# EAGLE design can-universalmodul (EAGLE 7.2.0)
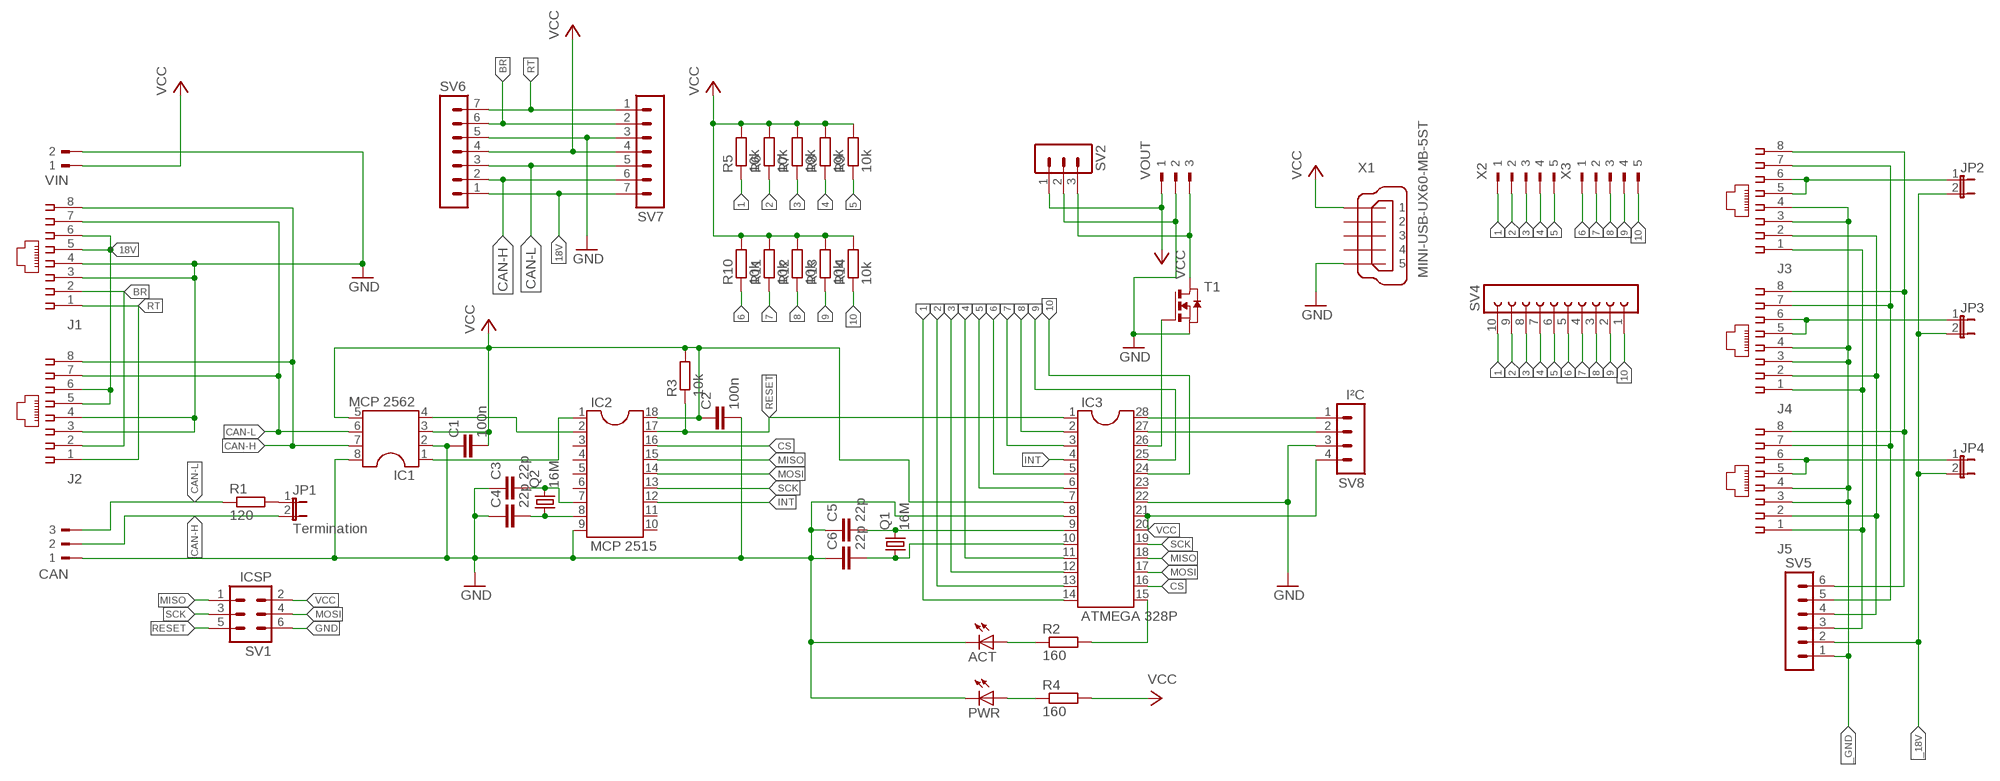
[diagram p0: schematic, sheet 1]

## Parts
ACT  LEDCHIP-LED0805  [CHIP-LED0805]
C1  100n  C-EUC0805K  [C0805K]
C2  100n  C-EUC0805K  [C0805K]
C3  22p  C-EUC0805K  [C0805K]
C4  22p  C-EUC0805K  [C0805K]
C5  22p  C-EUC0805K  [C0805K]
C6  22p  C-EUC0805K  [C0805K]
CAN  90-3  [90-3]
IC1  MCP 2562  DIL8S  [SOCKET-08]
IC2  MCP 2515  DIL18S  [SOCKET-18]
IC3  ATMEGA 328P  DIL28-3  [DIL28-3]
J1  215877-7  [215877-7]
J2  215877-7  [215877-7]
J3  215877-7  [215877-7]
J4  215877-7  [215877-7]
J5  215877-7  [215877-7]
JP1  Termination  JP1E  [JP1]
JP2  JP1E  [JP1]
JP3  JP1E  [JP1]
JP4  JP1E  [JP1]
PWR  LEDCHIP-LED0805  [CHIP-LED0805]
Q1  16M  CSM-7X-DU  [CSM-7X-DU]
Q2  16M  CSM-7X-DU  [CSM-7X-DU]
R1  120  R-EU_R0805  [R0805]
R2  160  R-EU_R0805  [R0805]
R3  10k  R-EU_R0805  [R0805]
R4  160  R-EU_R0805  [R0805]
R5  10k  R-EU_R0805  [R0805]
R6  10k  R-EU_R0805  [R0805]
R7  10k  R-EU_R0805  [R0805]
R8  10k  R-EU_R0805  [R0805]
R9  10k  R-EU_R0805  [R0805]
R10  10k  R-EU_R0805  [R0805]
R11  10k  R-EU_R0805  [R0805]
R12  10k  R-EU_R0805  [R0805]
R13  10k  R-EU_R0805  [R0805]
R14  10k  R-EU_R0805  [R0805]
SV1  ICSP  MA03-2  [MA03-2]
SV2  MA03-1  [MA03-1]
SV4  FE10W  [FE10W]
SV5  MA06-1  [MA06-1]
SV6  MA07-1  [MA07-1]
SV7  MA07-1  [MA07-1]
SV8  I²C  MA04-1  [MA04-1]
T1  NMOSSOT23  [SOT-23]
VIN  90-2  [90-2]
VOUT  90-3  [90-3]
X1  MINI-USB-UX60-MB-5ST  [UX60-MB-5ST]
X2  90-5  [90-5]
X3  90-5  [90-5]

## Nets
1: IC3.14 R5.1 SV4.10 X2.1
2: IC3.13 R6.1 SV4.9 X2.2
3: IC3.12 R7.1 SV4.8 X2.3
4: IC3.11 R8.1 SV4.7 X2.4
5: IC3.6 R9.1 SV4.6 X2.5
6: IC3.5 R10.1 SV4.5 X3.1
7: IC3.3 R11.1 SV4.4 X3.2
8: IC3.2 R12.1 SV4.3 X3.3
9: IC3.25 R13.1 SV4.2 X3.4
10: IC3.24 R14.1 SV4.1 X3.5
18V: J1.5 J1.6 J2.5 J2.6 SV6.1 SV7.7
_18V: JP2.2 JP3.2 JP4.2 SV5.2
_GND: J3.3 J3.4 J4.3 J4.4 J5.3 J5.4 SV5.1
BR: J1.2 J2.2 SV6.6 SV7.2
CAN-H: CAN.2 IC1.7 J1.8 J2.8 JP1.2 SV6.2 SV7.6
CAN-L: CAN.3 IC1.6 J1.7 J2.7 R1.1 SV6.3 SV7.5
CS: IC2.16 IC3.16
GND: ACT.C C1.1 C2.2 C3.1 C4.1 C5.1 C6.1 CAN.1 IC1.2 IC1.8 IC2.9 IC3.8 IC3.22 J1.3 J1.4 J2.3 J2.4 PWR.C SV1.6 SV2.2 SV6.5 SV7.3 SV8.3 T1.2(S) VIN.2 VOUT.2 X1.5
INT: IC2.12 IC3.4
MISO: IC2.15 IC3.18 SV1.1
MOSI: IC2.14 IC3.17 SV1.4
N$1: J5.5 J5.6 JP4.1
N$2: IC1.4 IC2.2
N$3: J4.5 J4.6 JP3.1
N$4: C4.2 IC2.8 Q2.1
N$5: JP1.1 R1.2
N$6: C3.2 IC2.7 Q2.2
N$7: C5.2 IC3.9 Q1.2
N$8: C6.2 IC3.10 Q1.1
N$9: IC1.1 IC2.1
N$10: J3.5 J3.6 JP2.1
N$11: J3.1 J4.1 J5.1 SV5.3
N$12: ACT.A R2.1
N$13: IC3.15 R2.2
N$14: J3.2 J4.2 J5.2 SV5.4
N$15: J3.7 J4.7 J5.7 SV5.5
N$16: J3.8 J4.8 J5.8 SV5.6
N$20: PWR.A R4.1
N$21: IC3.26 T1.3(G)
N$22: SV2.3 T1.1(D) VOUT.3
N$33: IC3.28 SV8.1
N$34: IC3.27 SV8.2
RESET: IC2.17 IC3.1 R3.1 SV1.5
RT: J1.1 J2.1 SV6.7 SV7.1
SCK: IC2.13 IC3.19 SV1.3
VCC: C1.2 C2.1 IC1.3 IC1.5 IC2.18 IC3.7 IC3.20 IC3.21 R3.2 R4.2 R5.2 R6.2 R7.2 R8.2 R9.2 R10.2 R11.2 R12.2 R13.2 R14.2 SV1.2 SV2.1 SV6.4 SV7.4 SV8.4 VIN.1 VOUT.1 X1.1
Unconnected: IC2.3 IC2.4 IC2.5 IC2.6 IC2.10 IC2.11 IC3.23 X1.2 X1.3 X1.4

## Library data of the parts
ACT PWR = led:LED: LED OSRAM: - CHIPLED LG R971, LG N971, LY N971, LG Q971, LY Q971, LO R971, LY R971 LH N974, LH R974 LS Q976, LO Q976, LY Q976 LO Q996 - Hyper CHIPLED LW Q18S LB Q993, LB Q99A, LB R99A - SideLED LS A670, LO A670, LY A670, LG A670, LP A670 LB A673, LV A673, LT A673, LW A673 LH A674 LY A675 LS A676, LA A676, LO A676, LY A676, LW A676 LS A679, LY A679, LG A679 - Hyper Micro SIDELED® LS Y876, LA Y876, LO Y876, LY Y876 LT Y87S - SmartLED LW L88C, LW L88S LB L89C, LB L89S, LG L890 LS L89K, LO L89K, LY L89K LS L896, LA L896, LO L896, LY L896 - TOPLED LS T670, LO T670, LY T670, LG T670, LP T670 LSG T670, LSP T670, LSY T670, LOP T670, LYG T670 LG T671, LOG T671, LSG T671 LB T673, LV T673, LT T673, LW T673 LH T674 LS T676, LA T676, LO T676, LY T676, LB T676, LH T676, LSB T676, LW T676 LB T67C, LV T67C, LT T67C, LS T67K, LO T67K, LY T67K, LW E67C LS E67B, LA E67B, LO E67B, LY E67B, LB E67C, LV E67C, LT E67C LW T67C LS T679, LY T679, LG T679 LS T770, LO T770, LY T770, LG T770, LP T770 LB T773, LV T773, LT T773, LW T773 LH T774 LS E675, LA E675, LY E675, LS T675 LS T776, LA T776, LO T776, LY T776, LB T776 LHGB T686 LT T68C, LB T68C - Hyper Mini TOPLED® LB M676 - Mini TOPLED Santana® LG M470 LS M47K, LO M47K, LY M47K Source: http://www.osram.convergy.de LUXEON: - LUMILED® LXK2-PW12-R00, LXK2-PW12-S00, LXK2-PW14-U00, LXK2-PW14-V00 LXK2-PM12-R00, LXK2-PM12-S00, LXK2-PM14-U00 LXK2-PE12-Q00, LXK2-PE12-R00, LXK2-PE12-S00, LXK2-PE14-T00, LXK2-PE14-U00 LXK2-PB12-K00, LXK2-PB12-L00, LXK2-PB12-M00, LXK2-PB14-N00, LXK2-PB14-P00, LXK2-PB14-Q00 LXK2-PR12-L00, LXK2-PR12-M00, LXK2-PR14-Q00, LXK2-PR14-R00 LXK2-PD12-Q00, LXK2-PD12-R00, LXK2-PD12-S00 LXK2-PH12-R00, LXK2-PH12-S00 LXK2-PL12-P00, LXK2-PL12-Q00, LXK2-PL12-R00 Source: www.luxeon.com KINGBRIGHT: KA-3528ASYC Source: www.kingbright.com
C1-C6 = rcl:C-EU: CAPACITOR, European symbol
CAN VOUT = con-weidmueller-sl35:90-3: WEIDMUELLER CLAMP CONNECTOR; OC_FARNELL: unknown; OC_NEWARK: unknown
IC1 = ic-package:DIL8: Dual In Line / Socket
IC2 = ic-package:DIL18: Dual In Line / Socket
IC3 = ic-package:DIL28: Dual In Line
J1-J5 = con-amp:215877-7: AMP connector
JP1-JP4 = jumper:JP1E: JUMPER
Q1 Q2 = crystal:CSM-7X-DU: SMD CRYSTAL Source: www.ecsxtal.com .. Crystal 3.6864MHz CSM_7X_DU.PDF; OC_FARNELL: unknown; OC_NEWARK: unknown
R1-R14 = rcl:R-EU_: RESISTOR, European symbol
SV1 = con-lstb:MA03-2: PIN HEADER; OC_FARNELL: unknown; OC_NEWARK: unknown
SV2 = con-lstb:MA03-1: PIN HEADER; OC_FARNELL: unknown; OC_NEWARK: unknown
SV4 = con-lsta:FE10W: FEMALE HEADER; OC_FARNELL: unknown; OC_NEWARK: unknown
SV5 = con-lstb:MA06-1: PIN HEADER; OC_FARNELL: unknown; OC_NEWARK: unknown
SV6 SV7 = con-lstb:MA07-1: PIN HEADER; OC_FARNELL: unknown; OC_NEWARK: unknown
SV8 = con-lstb:MA04-1: PIN HEADER; OC_FARNELL: unknown; OC_NEWARK: unknown
T1 = zetex:NMOSSOT23: MOS FET; OC_FARNELL: unknown; OC_NEWARK: unknown
VIN = con-weidmueller-sl35:90-2: WEIDMUELLER CLAMP CONNECTOR; OC_FARNELL: unknown; OC_NEWARK: unknown
X1 = con-hirose:MINI-USB-: MINI USB Connector Source: http://www.hirose.co.jp/cataloge_hp/e24000019.pdf; OC_FARNELL: unknown; OC_NEWARK: unknown
X2 X3 = con-weidmueller-sl35:90-5: WEIDMUELLER CLAMP CONNECTOR; OC_FARNELL: unknown; OC_NEWARK: unknown

## Board
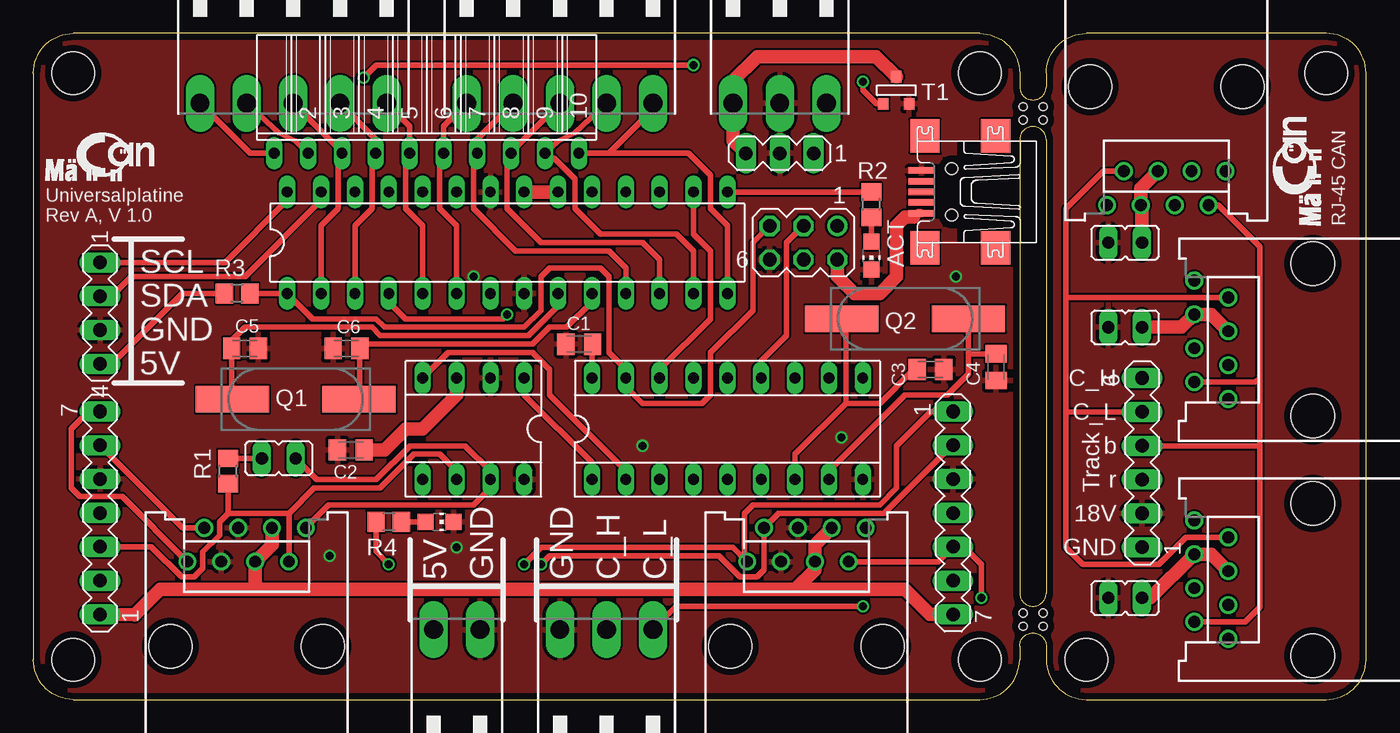
[diagram p1: board, top side]
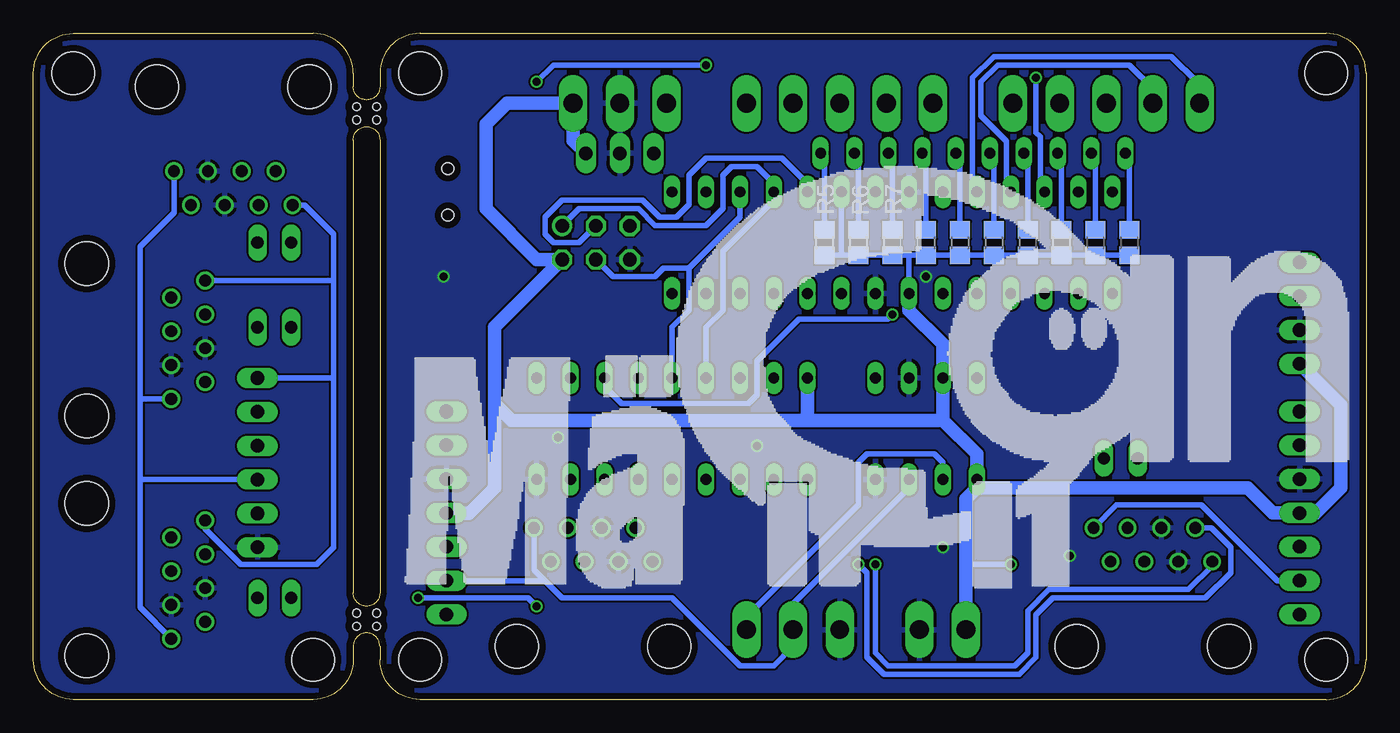
[diagram p2: board, bottom side, seen from below]

Size 100 x 50 mm. Coordinates in mm from the lower left corner, seen from the top.
Outline: 3,0 71,0 arc90 74,3 74,4 arc-90 75,5 arc-90 76,4 76,3 arc90 79,0 97,0 arc90 100,3 100,47 arc90 97,50 79,50 arc90 76,47 76,46 arc-90 75,45 arc-90 74,46 74,47 arc90 71,50 3,50 arc90 0,47 0,3 arc90 3,0
Outline: 74,42 74,8 arc90 75,7 arc90 76,8 76,42 arc90 75,43 arc90 74,42
Copper layers (1*16): Top 0.035mm / dielectric 1.6mm / Bottom 0.035mm
Design rules "Elecrow_2-layer_PCB_eagle_rule": minimum track width 6mil, minimum drill 12mil, track to track 6mil, track to pad 6mil, pad to pad 6mil, via to via 8mil, smd to smd 0mil, copper to edge 20mil, drill to drill 10mil, minimum pad ring 6mil, minimum via ring 6mil, stop-mask expansion 0mil, vias tented up to drill 100mil, thermal gap 10mil
Holes 3.2 mm at 3,3 71,3 3,47 71,47 79,3 97,47
Holes 0.6 mm at 74.25,6.5 74.25,5.5 75.75,6.5 75.75,5.5 74.25,44.5 74.25,43.5 75.75,44.5 75.75,43.5

### Footprints (pad centres in the part's own frame; a part is rotated, then mirrored left to right if it is on the bottom)
CHIP-LED0805 = smd 1.2 x 1.2: A 0,-1.05; C 0,1.05
C0805K = smd 1.3 x 1.6: 1 -1,0; 2 1,0
90-3 = drill 1.422 long: 1 -3.5,5.25; 2 0,5.25; 3 3.5,5.25
SOCKET-08 = drill 0.813 long: 1 -3.81,-3.81; 2 -1.27,-3.81; 3 1.27,-3.81; 4 3.81,-3.81; 5 3.81,3.81; 6 1.27,3.81; 7 -1.27,3.81; 8 -3.81,3.81
SOCKET-18 = drill 0.813 long: 1 -10.16,-3.81; 2 -7.62,-3.81; 3 -5.08,-3.81; 4 -2.54,-3.81; 5 0,-3.81; 6 2.54,-3.81; 7 5.08,-3.81; 8 7.62,-3.81; 9 10.16,-3.81; 10 10.16,3.81; 11 7.62,3.81; 12 5.08,3.81; 13 2.54,3.81; 14 0,3.81; 15 -2.54,3.81; 16 -5.08,3.81; 17 -7.62,3.81; 18 -10.16,3.81
DIL28-3 = drill 0.813 long: 1 -16.51,-3.81; 2 -13.97,-3.81; 3 -11.43,-3.81; 4 -8.89,-3.81; 5 -6.35,-3.81; 6 -3.81,-3.81; 7 -1.27,-3.81; 8 1.27,-3.81; 9 3.81,-3.81; 10 6.35,-3.81; 11 8.89,-3.81; 12 11.43,-3.81; 13 13.97,-3.81; 14 16.51,-3.81; 15 16.51,3.81; 16 13.97,3.81; 17 11.43,3.81; 18 8.89,3.81; 19 6.35,3.81; 20 3.81,3.81; 21 1.27,3.81; 22 -1.27,3.81; 23 -3.81,3.81; 24 -6.35,3.81; 25 -8.89,3.81; 26 -11.43,3.81; 27 -13.97,3.81; 28 -16.51,3.81
215877-7 = drill 0.889: 1 -4.445,6.35; 2 -3.175,8.89; 3 -1.905,6.35; 4 -0.635,8.89; 5 0.635,6.35; 6 1.905,8.89; 7 3.175,6.35; 8 4.445,8.89 | hole 3.251: -5.715,0; 5.715,0
JP1 = drill 0.914 long: 1 0,-1.27; 2 0,1.27
CSM-7X-DU = smd 5.5 x 2: 1 -4.75,0; 2 4.75,0
R0805 = smd 1.3 x 1.5: 1 -0.95,0; 2 0.95,0
MA03-2 = drill 1.016: 1 -2.54,-1.27 | drill 1.016 octagon: 2 -2.54,1.27; 3 0,-1.27; 4 0,1.27; 5 2.54,-1.27; 6 2.54,1.27
MA03-1 = drill 1.016 long: 1 -2.54,0; 2 0,0; 3 2.54,0
FE10W = drill 0.813 long: 1 -11.43,0; 2 -8.89,0; 3 -6.35,0; 4 -3.81,0; 5 -1.27,0; 6 1.27,0; 7 3.81,0; 8 6.35,0; 9 8.89,0; 10 11.43,0
MA06-1 = drill 1.016 long: 1 -6.35,0; 2 -3.81,0; 3 -1.27,0; 4 1.27,0; 5 3.81,0; 6 6.35,0
MA07-1 = drill 1.016 long: 1 -7.62,0; 2 -5.08,0; 3 -2.54,0; 4 0,0; 5 2.54,0; 6 5.08,0; 7 7.62,0
MA04-1 = drill 1.016 long: 1 -3.81,0; 2 -1.27,0; 3 1.27,0; 4 3.81,0
SOT-23 = smd 0.787 x 0.889: 1 0.025,-1.016; 2 -0.94,1.016; 3 0.991,1.016
90-2 = drill 1.422 long: 1 -1.75,5.25; 2 1.75,5.25
UX60-MB-5ST = smd 2 x 0.5: 1 2.25,1.6; 2 2.25,0.8; 3 2.25,0; 4 2.25,-0.8; 5 2.25,-1.6 | smd 2.2 x 2.5: M1 -3.3,-4.2; M2 -3.3,4.2; M3 2,4.2; M4 2,-4.2 | hole 0.9: 0,-1.75; 0,1.75
90-5 = drill 1.422 long: 1 -7,5.25; 2 -3.5,5.25; 3 0,5.25; 4 3.5,5.25; 5 7,5.25

### Placement (x,y rotation side)
ACT  62.87,33.34 180 top
C1  40.96,26.67 0 top
C2  23.81,18.73 180 top
C3  67.31,24.77 180 top
C4  72.23,24.95 90 top
C5  15.88,26.35 180 top
C6  23.5,26.35 0 top
CAN  43,0 0 top
IC1  33.02,20.32 180 top
IC2  52.07,20.32 0 top
IC3  35.56,34.29 0 top
J1  58,4 0 top
J2  16,4 0 top
J3  85,46 180 top
J4  96,9 90 top
J5  96,27 90 top
JP1  18.41,18.1 270 top
JP2  81.92,34.29 90 top
JP3  81.92,7.62 90 top
JP4  81.92,27.94 90 top
PWR  30.48,13.34 270 top
Q1  19.68,22.54 180 top
Q2  65.41,28.57 180 top
R1  14.61,17.14 90 top
R2  62.87,37.15 90 top
R3  15.29,30.48 180 top
R4  26.67,13.34 180 top
R5  40.64,34.29 270 bottom
R6  38.1,34.29 270 bottom
R7  35.56,34.29 270 bottom
R8  33.02,34.29 270 bottom
R9  30.48,34.29 270 bottom
R10  27.94,34.29 270 bottom
R11  25.4,34.29 270 bottom
R12  22.86,34.29 270 bottom
R13  20.32,34.29 270 bottom
R14  17.78,34.29 270 bottom
SV1  57.78,34.29 180 top
SV2  56,41 180 top
SV4  29.5,41 0 top
SV5  83.19,17.78 90 top
SV6  5,14 90 top
SV7  69,14 270 top
SV8  5,29 270 top
T1  64.77,45.72 180 top
VIN  31.77,0 0 top
VOUT  56,50 180 top
X1  68.9,38.1 180 top
X2  39.5,50 180 top
X3  19.5,50 180 top

### Tracks (layer width: path | path; a pad name or v marks a point on that pad's centre or on a via)
1
  Top 0.406: IC3.14 52.07,35.56 50.8,36.83 50.8,39.37 49.17,41 43.18,41 | SV4.10 43.18,41 | X2.1 46.5,44.32 43.18,41
  Bottom 0.406: R5.1 40.64,40.71 SV4.10
2
  Top 0.406: X2.2 40.64,42.55 39.37,41.91 SV4.9 38.75,40.64 39.05,40.64 40.64,39.05 40.64,36.83 42.55,34.92 48.26,34.92 49.53,33.66 IC3.13
  Bottom 0.406: R6.1 38.1,40.71 SV4.9
3
  Top 0.406: X2.3 35.85,41.1 SV4.8 35.56,40.71 35.56,36.83 38.1,34.29 45.72,34.29 46.99,33.02 IC3.12
  Bottom 0.406: R7.1 35.56,40.71 SV4.8
4
  Top 0.406: X2.4 33.31,42.06 SV4.7 33.02,40.71 33.02,36.83 36.2,33.66 43.18,33.66 44.45,32.38 IC3.11
  Bottom 0.406: R8.1 33.02,40.71 SV4.7
5
  Top 0.406: X2.5 30.77,43.02 SV4.6 30.48,40.71 30.48,36.83 31.75,35.56 IC3.6
  Bottom 0.406: R9.1 30.48,40.71 SV4.6
6
  Top 0.406: X3.1 28.23,43.02 SV4.5 27.94,40.71 27.94,36.83 29.21,35.56 IC3.5
  Bottom 0.406: R10.1 27.94,40.71 SV4.5
7
  Top 0.406: X3.2 25.69,42.06 SV4.4 25.4,40.71 25.4,36.83 24.13,35.56 IC3.3
  Bottom 0.406: R11.1 25.4,40.71 SV4.4
8
  Top 0.406: X3.3 23.15,41.1 SV4.3 22.86,40.71 22.86,36.83 21.59,35.56 IC3.2
  Bottom 0.406: R12.1 22.86,40.71 SV4.3
9
  Top 0.406: SV4.2 19.68,41.91 18.41,42.55 X3.4
  Bottom 0.406: R13.1 20.32,40.71 SV4.2 | IC3.25 26.67,38.42 26.99,38.73 26.99,41.91 28.89,43.81 28.89,46.35 27.62,47.62 17.78,47.62 15.88,45.72 15.88,44.88 X3.4
10
  Top 0.406: SV4.1 16.25,41 X3.5
  Bottom 0.406: R14.1 17.78,40.71 SV4.1 | IC3.24 29.21,38.73 29.53,39.05 29.53,46.67 27.94,48.26 14.61,48.26 12.7,46.35 12.7,44.95 X3.5
18V
  Top 1.016: J2.6 17.91,11.62 J2.5 16.64,8.62 17,8.26 | J1.6 58.63,11.62 J1.5 58.63,9.74 57.15,8.26 | 57.15,8.26 17,8.26 | 17,8.26 9.53,8.26 7.62,6.35 SV6.1 | SV7.7 67.28,6.38 65.41,8.26 57.15,8.26
_18V
  pour Top: 76,47 arc-90 79,50 97,50 arc-90 100,47 100,3 arc-90 97,0 79,0 arc-90 76,3
_GND
  pour Bottom: 76,47 arc-90 79,50 97,50 arc-90 100,47 100,3 arc-90 97,0 79,0 arc-90 76,3
BR  (via drill 0.6)
  Top 0.406: v38.1,10.16 38.73,10.79 51.44,10.79 53.02,9.21 54.29,9.21 54.83,9.74 J1.2 55.88,13.95 55.88,13.97 63.82,13.97 68.93,19.08 SV7.2 | SV6.6 11.19,12.89 J2.2
  Bottom 0.406: J2.2 11.62,12.89 10.16,11.43 10.16,9.53 12.06,7.62 23.5,7.62 24.77,6.35 24.77,3.17 26.04,1.91 36.2,1.91 37.47,3.17 37.47,9.53 v38.1,10.16
CAN-H
  Top 0.406: JP1.2 21.27,16.51 25.72,16.51 28.26,19.05 32.38,19.05 34.29,17.14 IC1.7 34.29,15.88 33.02,14.61 22.16,14.61 J2.8
  Bottom 0.406: IC1.7 34.29,15.88 43,7.17 CAN.2 43,3.99 44.45,2.54 46.99,2.54 52.07,7.62 60.33,7.62 61.62,8.92 | J1.8 62.45,9.74 61.62,8.92 | J2.8 18.73,14.61 12.38,14.61 6.67,8.89 SV6.2 | SV7.6 61.62,8.92
CAN-L  (via drill 0.6)
  Top 0.406: J2.7 19.18,13.97 | 14.61,13.97 19.18,13.97 | R1.1 14.61,13.97 | 19.18,13.97 21.08,15.88 26.04,15.88 28.57,18.41 30.48,18.41 31.75,17.14 IC1.6 | v71.12,7.62 71.12,10.16 69.82,11.46 SV7.5 67.89,10.35 J1.7 | v62.23,6.99 48.23,6.99 CAN.3 | 14.61,13.97 13.97,13.34 13.97,12.34 12.7,11.06 12.7,9.84 12.06,9.21 11.11,9.21 8.86,11.46 SV6.3
  Bottom 0.406: IC1.6 31.75,17.78 32.38,18.41 37.47,18.41 38.1,17.78 38.1,14.61 46.35,6.35 46.35,5.71 46.5,5.57 CAN.3 | v71.12,7.62 62.87,7.62 v62.23,6.99
CS
  Top 0.406: IC3.16 49.53,34.92 50.8,33.66 50.8,28.57 46.99,24.77 IC2.16
GND  (via drill 0.6)
  other vias: 60.64,19.68 45.72,19.05 33.02,31.75 69.22,31.75 22.23,10.79 31.75,11.43
  pour Top: 0,47 arc-90 3,50 71,50 arc-90 74,47 74,3 arc-90 71,0 3,0 arc-90 0,3
  pour Bottom: 0,47 arc-90 3,50 71,50 arc-90 74,47 74,3 arc-90 71,0 3,0 arc-90 0,3
INT  (via drill 0.6)
  Top 0.406: IC3.4 26.67,29.84 27.94,28.57 35.24,28.57 v35.56,28.89
  Bottom 0.406: v35.56,28.89 35.88,28.57 42.55,28.57 45.72,25.4 45.72,22.86 46.35,22.23 55.88,22.23 57.15,23.5 IC2.12
MISO
  Bottom 0.406: IC2.15 49.53,27.94 48.26,29.21 48.26,33.66 44.45,37.47 IC3.18 44.45,38.73 45.72,40.01 47.62,40.01 48.26,39.37 48.26,36.83 49.53,35.56 53.34,35.56 54.61,36.83 59.05,36.83 SV1.1
MOSI
  Bottom 0.406: IC2.14 52.07,27.94 50.8,29.21 50.8,32.38 | SV1.4 56.52,31.75 53.34,31.75 52.7,32.38 50.8,32.38 | IC3.17 46.99,36.2 50.8,32.38
N$1
  Top 1.016: JP4.1 86.14,27.94 J5.6 88.38,28.91 J5.5
N$2
  Top 0.406: IC1.4 31.11,26.04 37.47,26.04 38.73,24.77 38.73,22.86 44.45,17.14 IC2.2
N$3
  Top 1.016: J4.5 88.38,10.9 J4.6 83.82,7.62 JP3.1
N$4
  Top 0.406: 70.16,26.04 70.16,24.43 68.58,22.86 65.41,22.86 59.69,17.14 IC2.8 | 70.16,26.04 Q2.1 | C4.2 70.25,25.95 70.16,26.04
N$5
  Top 0.406: R1.2 JP1.1
N$6
  Top 0.406: IC2.7 57.15,18.41 60.96,22.23 | 60.96,22.23 60.96,28.57 Q2.2 | C3.2 66.04,24.77 63.5,22.23 60.96,22.23
N$7
  Top 0.406: Q1.2 14.88,22.29 C5.2 14.88,26.94 15.88,27.94 25.4,27.94 26.04,27.3 37.15,27.3 39.37,29.53 IC3.9
N$8
  Top 0.406: C6.2 24.5,22.29 Q1.1 | C6.2 24.45,26.35 | IC3.10 41.91,29.84 40.01,27.94 38.73,27.94 37.47,26.67 24.81,26.67 C6.2
N$9
  Top 0.406: IC1.1 36.83,22.86 41.91,17.78 IC2.1
N$10
  Top 1.016: JP2.1 83.19,37.02 J3.6 83.09,38.38 J3.5
N$11
  Bottom 0.406: J3.1 89.44,36.55 92,34 92,22.54 | 92,22.54 92,16.51 | 92,16.51 92,6.91 J4.1 | J5.1 91.99,22.55 92,22.54 | SV5.3 92,16.51
N$12
  Top 0.406: R2.1 62.87,35.24 ACT.A
N$13
  Top 0.406: IC3.15 59.37,38.1 R2.2
N$14
  Top 0.406: J3.2 88.89,37.11 92,34 92,24.13 | 92,24.13 92,19.05 | 92,19.05 92,6.91 90.92,5.83 J4.2 | J5.2 91.69,23.82 92,24.13 | SV5.4 92,19.05
N$15
  Top 0.406: J3.7 80.29,39.65 77.47,36.83 77.47,30.16 | 77.47,30.16 77.47,21.59 | 77.47,21.59 77.47,11.43 78.74,10.16 84.45,10.16 86.47,12.18 J4.7 | J5.7 77.48,30.18 77.47,30.16 | SV5.5 77.47,21.59
N$16
  Bottom 0.406: J3.8 79.66,37.11 77.47,34.92 77.47,31.43 | 77.47,31.43 77.47,24.13 | 77.47,24.13 77.47,11.43 78.74,10.16 84.45,10.16 87.11,12.81 J4.8 | J5.8 77.48,31.45 77.47,31.43 | SV5.6 77.47,24.13
N$20
  Top 0.406: R4.1 PWR.A
N$21  (via drill 0.6)
  Top 0.406: v24.77,46.67 25.72,47.62 v49.53,47.62 | v62.23,46.35 62.23,45.72 63.25,44.7 T1.3
  Bottom 0.406: IC3.26 24.13,38.42 24.45,38.73 24.45,42.23 24.77,42.55 v24.77,46.67 | v49.53,47.62 60.96,47.62 v62.23,46.35
N$22
  Top 1.016: T1.1 63.22,48.26 54.34,48.26 52.44,46.35 52.44,45.31 VOUT.3 52.5,41.96 SV2.3
N$33
  Top 0.406: SV8.1 14.39,32.81 19.05,37.47 IC3.28
N$34
  Top 0.406: SV8.2 5.87,30.27 7.35,31.75 15.88,31.75 21.59,37.47 IC3.27
RESET
  Top 0.406: R3.1 IC3.1 20.95,28.57 25.72,28.57 26.35,27.94 36.83,27.94 38.1,29.21 38.1,31.75 38.73,32.38 42.55,32.38 43.18,31.75 43.18,26.04 44.45,24.77 IC2.17 44.45,23.5 45.72,22.23 50.16,22.23 50.8,22.86 50.8,26.04 53.98,29.21 53.98,34.29 SV1.5
RT  (via drill 0.6)
  Top 0.406: v36.83,10.16 38.1,11.43 52.48,11.43 J1.1 53.34,10.56 53.34,13.97 53.98,14.61 63.5,14.61 64.77,15.88 64.77,19.05 67.34,21.62 SV7.1 | J2.1 6.67,15.24 3.49,15.24 2.86,15.88 2.86,20.32 4.16,21.62 SV6.7
  Bottom 0.406: J2.1 11.55,10.04 13.34,8.26 23.81,8.26 25.4,6.67 25.4,3.49 26.35,2.54 35.88,2.54 36.83,3.49 v36.83,10.16
SCK
  Top 0.406: SV1.3 56.52,34.29 56.52,27.3 54.61,25.4 IC2.13
  Bottom 0.406: IC3.19 41.91,38.73 43.81,40.64 49.53,40.64 50.8,39.37 50.8,37.15 51.75,36.2 53.02,36.2 54.29,37.47 60.33,37.47 61.59,36.2 61.59,34.92 60.96,34.29 59.05,34.29 SV1.3
VCC  (via drill 0.6)
  Top 0.406: C1.2 41.91,26.04 IC2.18 | SV8.4 5.87,25.19 11.16,30.48 R3.2 | R4.2 25.72,11.11 v26.67,10.16
  Top 0.61: X1.1 66.34,36.5 66.04,36.2
  Top 1.016: IC3.21 IC3.20 | 31.75,23.5 IC1.3 31.75,22.86 29.21,20.32 27.94,20.32 26.35,18.73 C2.1 | SV1.2 60.33,31.75 61.59,30.48 63.5,30.48 64.77,31.75 64.77,35.56 65.41,36.2 66.04,36.2
  Bottom 0.406: v26.67,10.16 30.02,10.16 | R14.2 R13.2 R12.2 R11.2 R10.2 R9.2 R8.2 R7.2 | R5.2 39.37,33.34 | 39.37,33.34 R6.2 R7.2 | R7.2 34.29,33.34 IC3.7 | IC3.20 39.37,33.34
  Bottom 1.016: IC1.5 29.21,15.88 | 29.18,16.54 IC1.5 | IC1.5 29.21,18.41 31.75,20.95 | 31.75,20.95 41.91,20.95 | 41.91,20.95 64.14,20.95 65.41,22.23 | IC2.18 41.91,20.95 | 31.75,20.95 IC1.3 31.75,26.67 34.29,29.21 IC3.7 | 65.41,22.23 65.41,27.94 SV1.2 62.23,33.02 66.04,36.83 66.04,43.18 64.47,44.75 VOUT.1 59.5,41.96 SV2.1 | 29.21,15.88 8.88,15.88 7,14 SV6.4 3.81,13.97 1.91,15.88 1.91,22.09 SV8.4 | VIN.1 30.02,10.16 30.02,15.06 29.21,15.88 | SV7.4 68.97,13.97 67.31,13.97 65.41,15.88 65.41,22.23

### Text on the board
tNames: Universalplatine / Rev A, V 1.0 | RJ-45 CAN | SCL | SDA | GND | C_H | 5V | C_L | b | r | Track | 18V | GND | 5V | GND | GND | C_H | C_L